# EAGLE schematic Rover V0 (EAGLE 8.3.1)

## Sheet 1 of 4
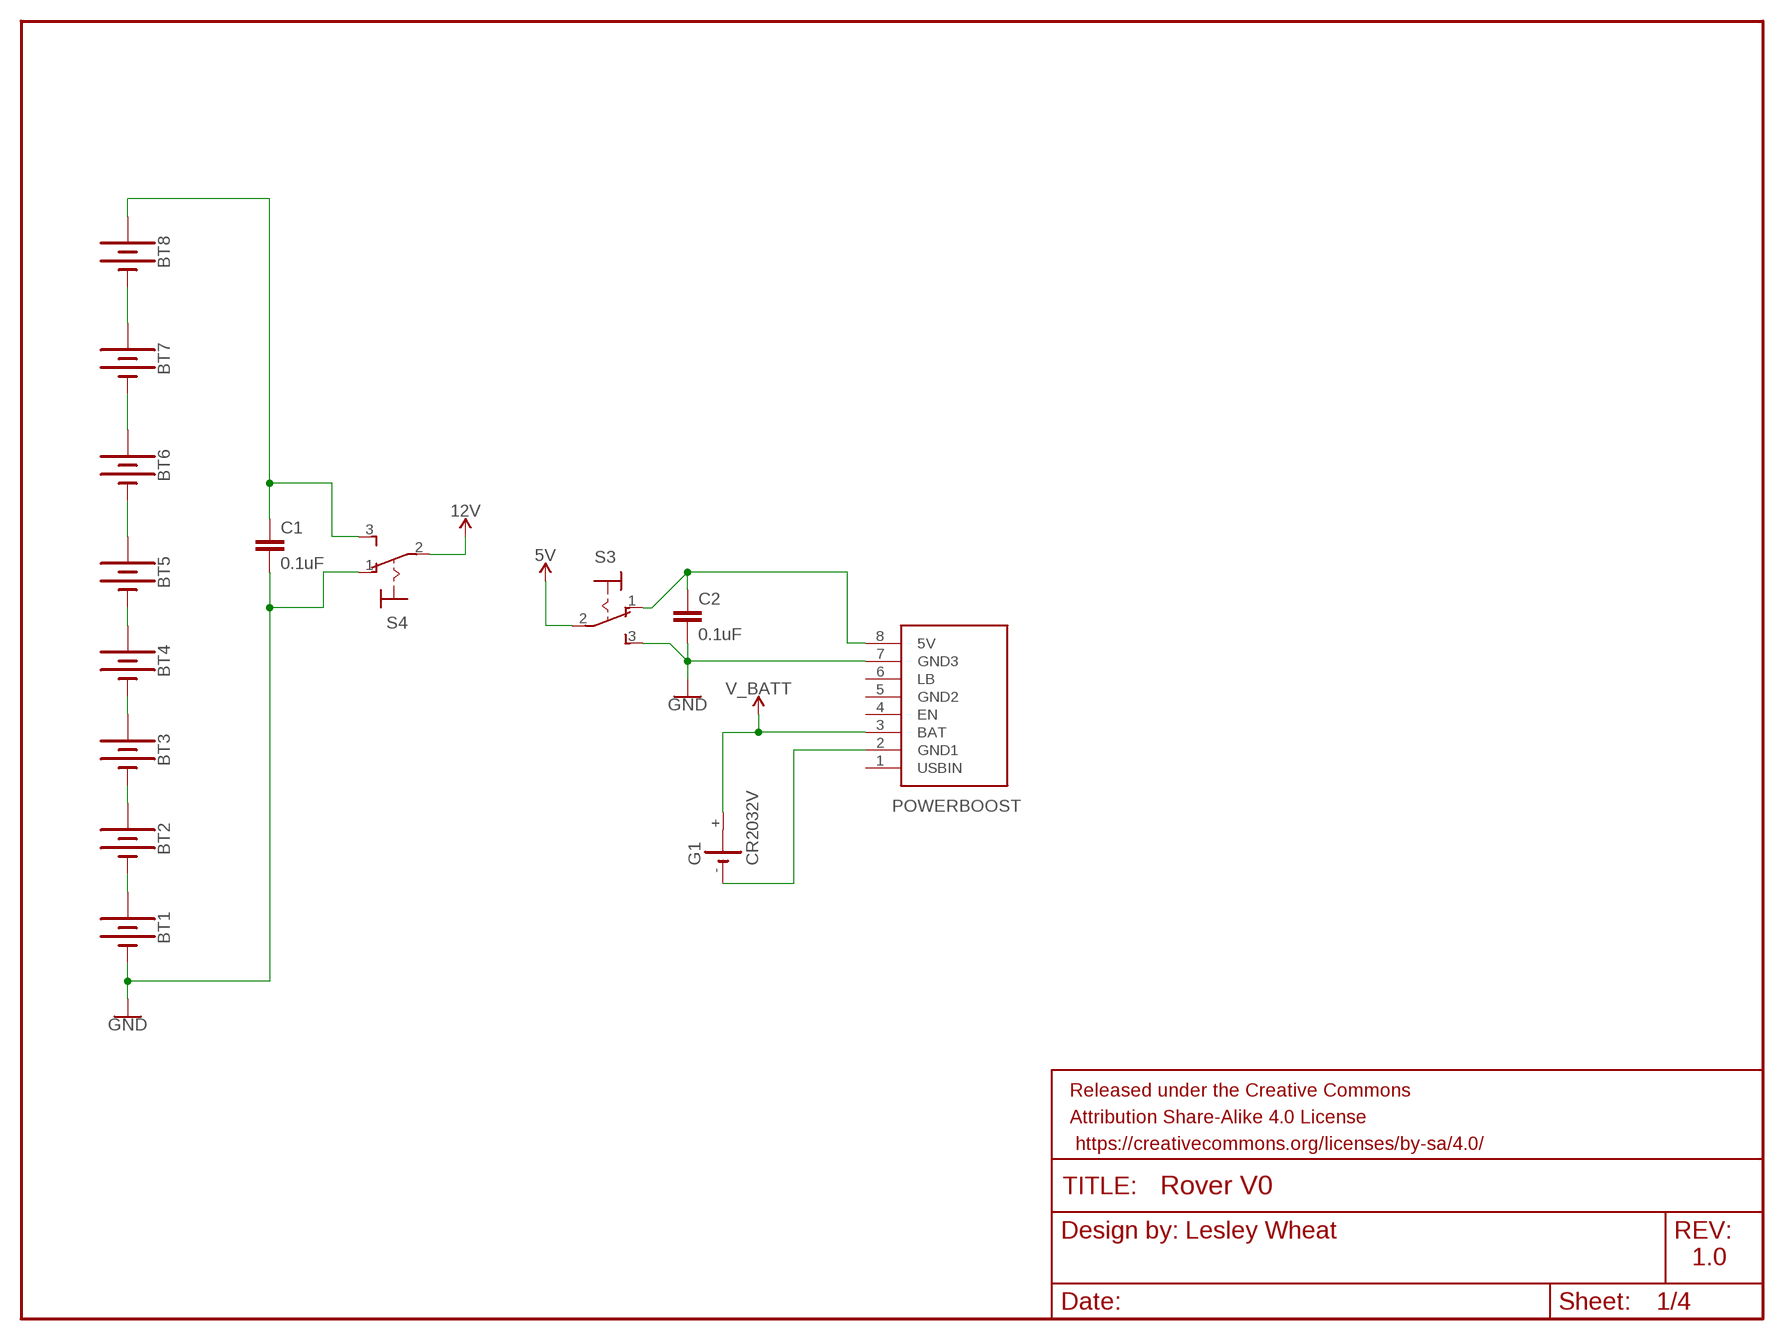
[diagram p0: schematic, sheet 1]

### Parts
BT1  BATTERY-AA  [BATTERY-AA]
BT2  BATTERY-AA  [BATTERY-AA]
BT3  BATTERY-AA  [BATTERY-AA]
BT4  BATTERY-AA  [BATTERY-AA]
BT5  BATTERY-AA  [BATTERY-AA]
BT6  BATTERY-AA  [BATTERY-AA]
BT7  BATTERY-AA  [BATTERY-AA]
BT8  BATTERY-AA  [BATTERY-AA]
C1  0.1uF  0.1UF-0402-16V-10%  [0402]
C2  0.1uF  0.1UF-0402-16V-10%  [0402]
FRAME1  FRAME-LETTER  [CREATIVE_COMMONS]
G1  CR2032V  [CR2032V]
S3  M9040P  [M9040P]
S4  M9040P  [M9040P]
U$1  POWERBOOST500C  [POWERBOOST500]

### Nets
5V: S3.2(P) ; also sheet 2,3,4
12V: S4.2(P) ; also sheet 2
GND: BT1.GND@1(-) C1.2 C2.2 S3.3(S) S4.1(O) U$1.7(GND3) ; also sheet 2,3,4
N$1: BT1.PWR@1(+) BT2.GND@1(-)
N$2: BT2.PWR@1(+) BT3.GND@1(-)
N$3: BT3.PWR@1(+) BT4.GND@1(-)
N$4: BT4.PWR@1(+) BT5.GND@1(-)
N$5: BT5.PWR@1(+) BT6.GND@1(-)
N$6: BT6.PWR@1(+) BT7.GND@1(-)
N$7: BT7.PWR@1(+) BT8.GND@1(-)
N$8: G1.- U$1.2(GND1)
N$19: BT8.PWR@1(+) C1.1 S4.3(S)
N$21: C2.1 S3.1(O) U$1.8(5V)
V_BATT: G1.+ U$1.3(BAT) ; also sheet 2
Unconnected: G1.+@1(+) U$1.1(USBIN) U$1.4(EN) U$1.5(GND2) U$1.6(LB)

### Notes on the sheet
- Lesley Wheat
- 1.0

## Sheet 2 of 4
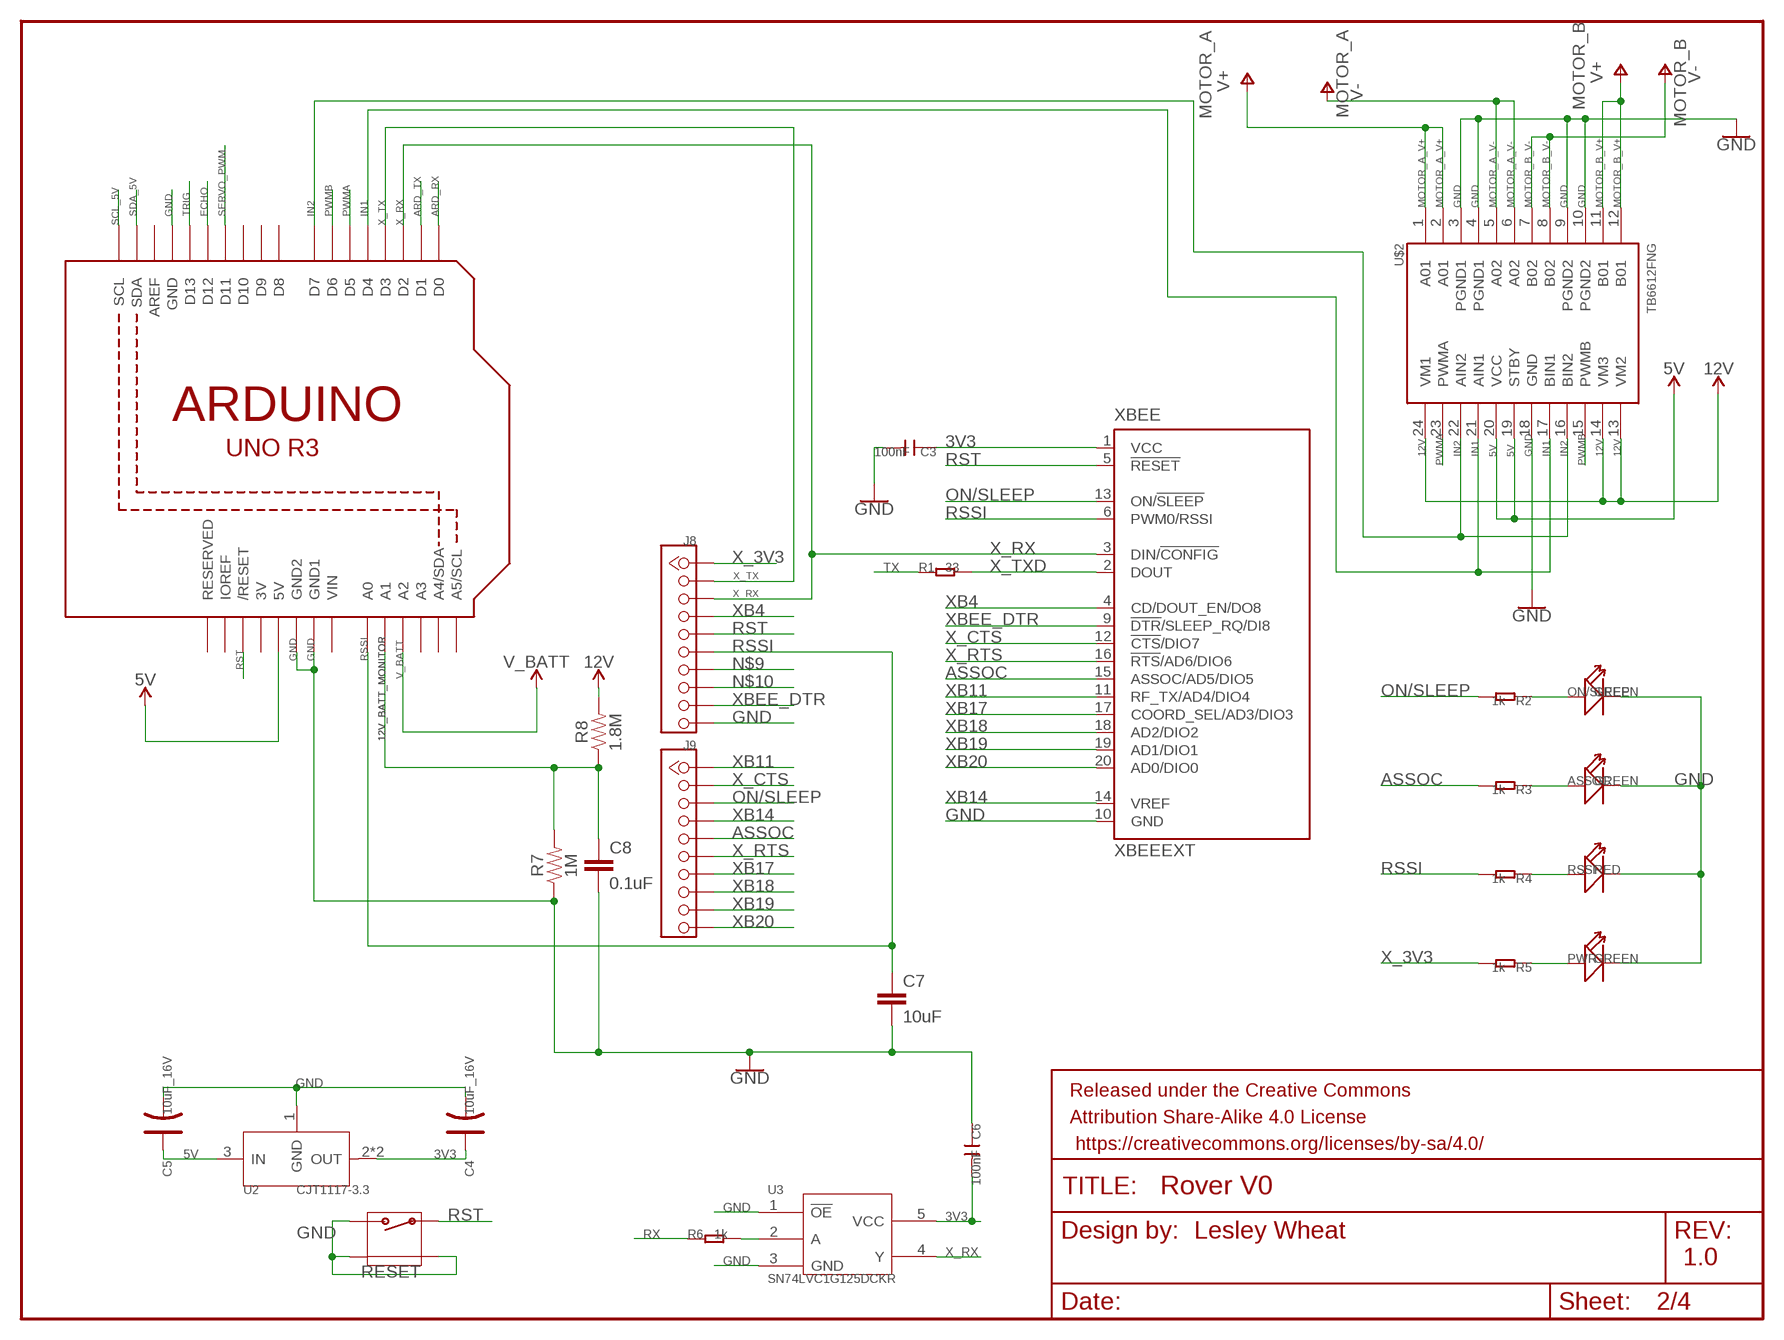
[diagram p1: schematic, sheet 2]

### Parts
ASSOC  GREEN  LED'0603'  [LED-0603]
C3  100nF  C-0603  [C0603]
C4  10uF_16V  CAP-AVX-A  [AVX-A]
C5  10uF_16V  CAP-AVX-A  [AVX-A]
C6  100nF  C-0603  [C0603]
C7  10uF  10UF-0603-6.3V-20%  [0603]
C8  0.1uF  0.1UF-0402-16V-10%  [0402]
FRAME2  FRAME-LETTER  [CREATIVE_COMMONS]
J8  DNP  CK1X10DD  [CK1X10]
J9  DNP  CK1X10DD  [CK1X10]
ON/SLEEP  GREEN  LED'0603'  [LED-0603]
PWR  GREEN  LED'0603'  [LED-0603]
R1  33  R-0603  [R0603]
R2  1k  R-0603  [R0603]
R3  1k  R-0603  [R0603]
R4  1k  R-0603  [R0603]
R5  1k  R-0603  [R0603]
R6  1k  R-0603  [R0603]
R7  1M  1MOHM-0603-1/4W-5%  [0603]
R8  1.8M  1.8MOHM  [0603]
RESET  FOR_TEST_ALBERT_V6_BUTTON_4P_SMD  [FOR_TEST_ALBERT_V6_4P-SMD-7X3.5X3.5]
RSSI  RED  LED'0603'  [LED-0603]
U2  CJT1117-3.3  LD1117S  [SOT-223]
U3  SN74LVC1G125DCKR  [SOT353]
U4  ARDUINOR3-BPLACE  [ARDUINOR3-BPLACE]
U$2  TB6612FNG  [SSOP24]
XBEE  XBEEEXT  [XBEE_PLUG]

### Nets
3V3: C3.1 C4.+ C6.2 U2.2(OUT) U2.TER(OUT) U3.5(VCC) XBEE.1(VCC)
5V: C5.+ U2.3(IN) U4.5V U$2.19(STBY) U$2.20(VCC) ; also sheet 1,3,4
12V: R8.2 U$2.13(VM2) U$2.14(VM3) U$2.24(VM1) ; also sheet 1
12V_BATT_MONITOR: C8.1 R7.2 R8.1 U4.A1
ARD_RX: U4.D0 ; also sheet 4
ARD_TX: U4.D1 ; also sheet 4
ASSOC: J9.5 R3.2 XBEE.15(ASSOC/AD5/DIO5)
ECHO: U4.D12 ; also sheet 3
GND: ASSOC.- C3.2 C4.- C5.- C6.1 C7.2 C8.2 J8.10 ON/SLEEP.- PWR.- R7.1 RESET.2 RESET.S1 RESET.S2 RSSI.- U2.1(GND) U3.1(!OE!) U3.3(GND) U4.GND U4.GND1 U4.GND2 U$2.3(PGND1) U$2.4(PGND1) U$2.9(PGND2) U$2.10(PGND2) U$2.18(GND) XBEE.10(GND) ; also sheet 1,3,4
IN1: U4.D4 U$2.17(BIN1) U$2.21(AIN1)
IN2: U4.D7 U$2.16(BIN2) U$2.22(AIN2)
MOTOR_A_V+: U$2.1(A01) U$2.2(A01) ; supply symbol labelled V+
MOTOR_A_V-: U$2.5(A02) U$2.6(A02) ; supply symbol labelled V-
MOTOR_B_V+: U$2.11(B01) U$2.12(B01) ; supply symbol labelled V+
MOTOR_B_V-: U$2.7(B02) U$2.8(B02) ; supply symbol labelled V-
N$9: J8.7 ON/SLEEP.+ R2.1
N$10: ASSOC.+ J8.8 R3.1
N$11: R4.1 RSSI.+
N$14: PWR.+ R5.1
N$132: R6.2 U3.2(A)
ON/SLEEP: J9.3 R2.2 XBEE.13(ON/!SLEEP)
PWMA: U4.D5 U$2.23(PWMA)
PWMB: U4.D6 U$2.15(PWMB)
RSSI: C7.1 J8.6 R4.2 U4.A0 XBEE.6(PWM0/RSSI)
RST: J8.5 RESET.1 U4.RESET(/RESET) XBEE.5(!RESET) ; also sheet 4
RX: R6.1
SCL_5V: U4.SCL ; also sheet 3
SDA_5V: U4.SDA ; also sheet 3
SERVO_PWM: U4.D11 ; also sheet 3
TRIG: U4.D13 ; also sheet 3
TX: R1.1
V_BATT: U4.A2 ; also sheet 1
X_3V3: J8.1 R5.2
X_CTS: J9.2 XBEE.12(!CTS!/DIO7)
X_RTS: J9.6 XBEE.16(!RTS!/AD6/DIO6)
X_RX: J8.3 U3.4(Y) U4.D2 XBEE.3(DIN/!CONFIG)
X_TX: J8.2 U4.D3
X_TXD: R1.2 XBEE.2(DOUT)
XB4: J8.4 XBEE.4(CD/DOUT_EN/DO8)
XB11: J9.1 XBEE.11(RF_TX/AD4/DIO4)
XB14: J9.4 XBEE.14(VREF)
XB17: J9.7 XBEE.17(COORD_SEL/AD3/DIO3)
XB18: J9.8 XBEE.18(AD2/DIO2)
XB19: J9.9 XBEE.19(AD1/DIO1)
XB20: J9.10 XBEE.20(AD0/DIO0)
XBEE_DTR: J8.9 XBEE.9(!DTR!/SLEEP_RQ/DI8)
Unconnected: U4.A3 U4.A4(A4/SDA) U4.A5(A5/SCL) U4.AREF U4.D8 U4.D9 U4.D10 U4.IOREF U4.RESERVED

### Notes on the sheet
- Lesley Wheat
- 1.0

## Sheet 3 of 4
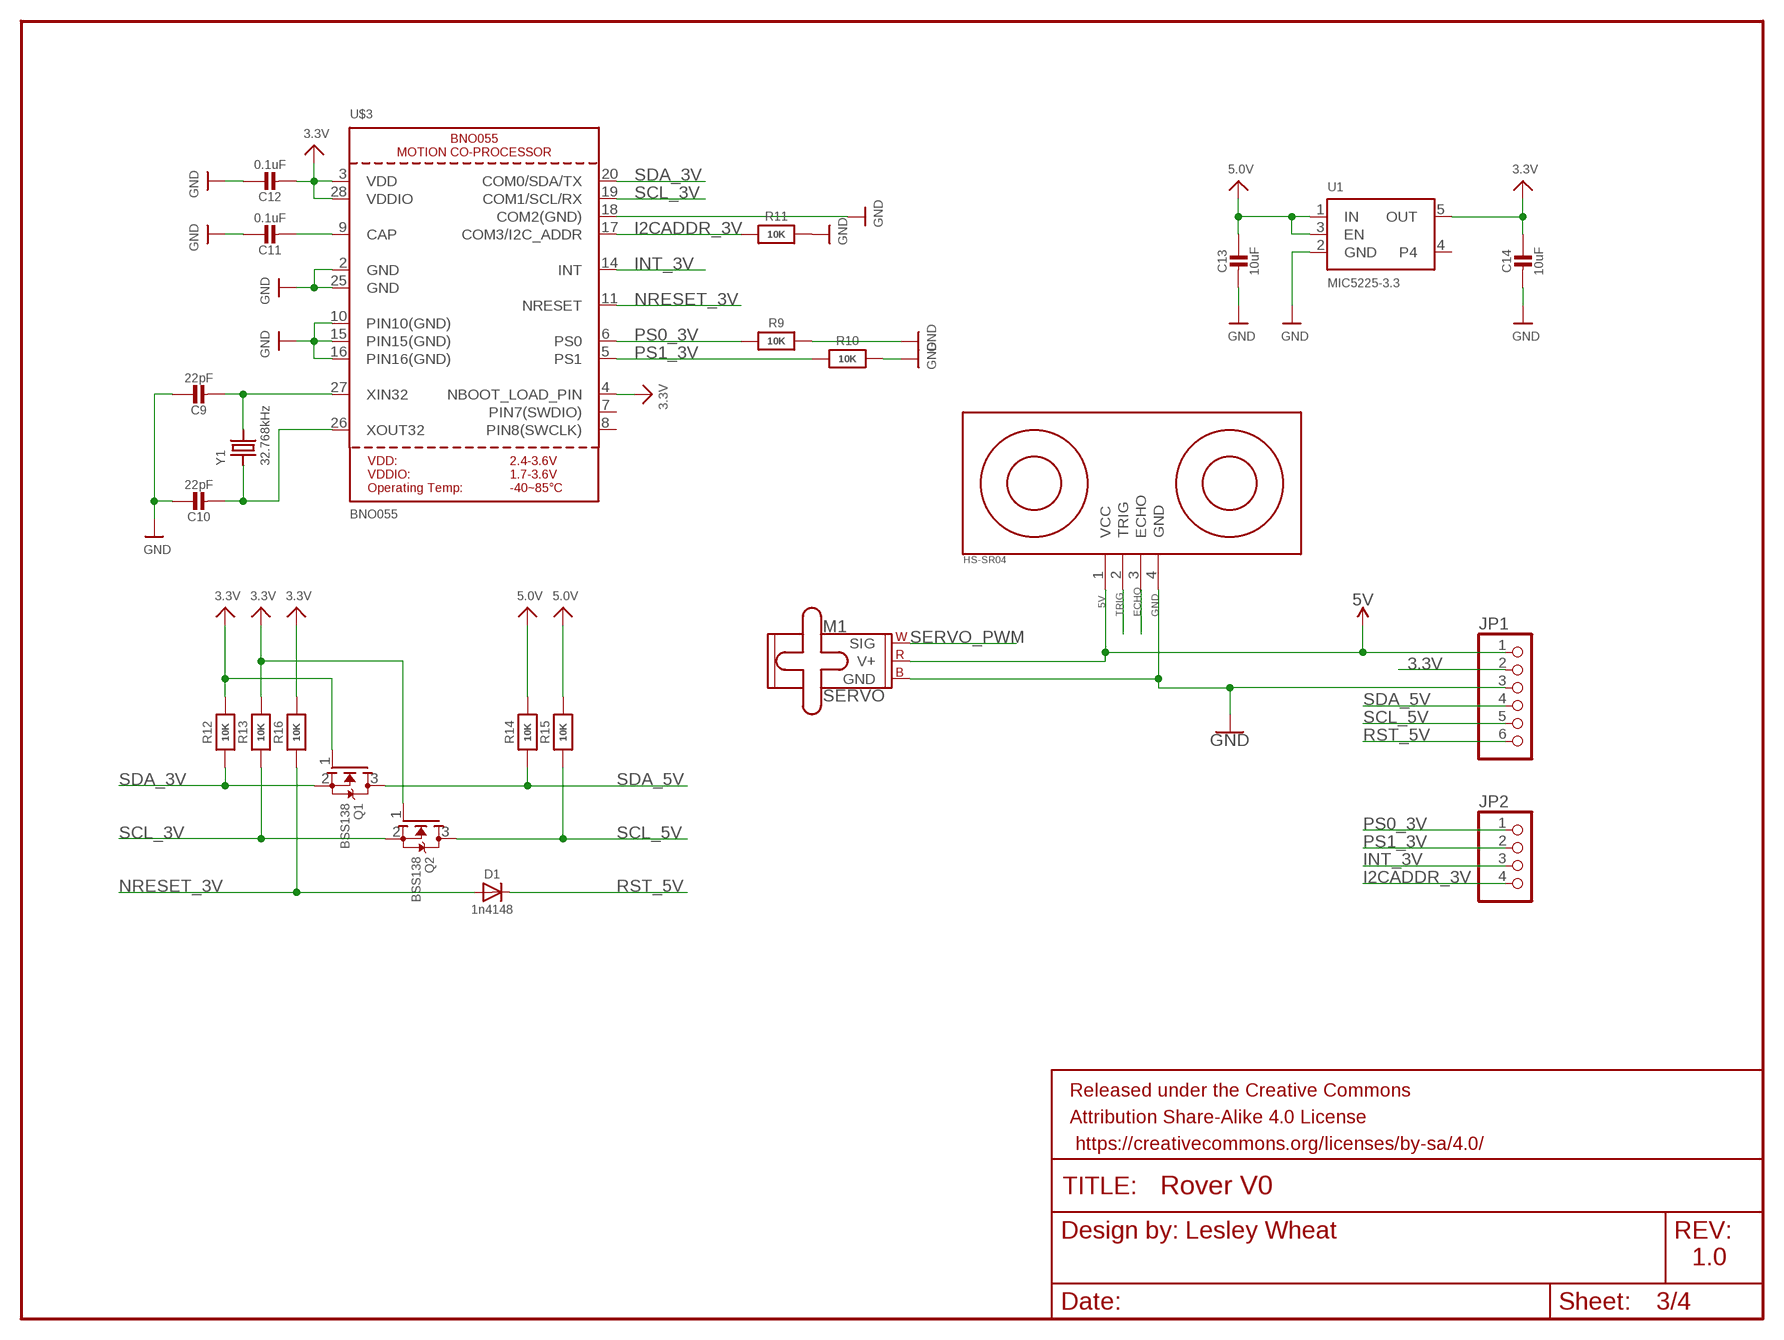
[diagram p2: schematic, sheet 3]

### Parts
C9  22pF  CAP_CERAMIC0805-NOOUTLINE  [0805-NO]
C10  22pF  CAP_CERAMIC0805-NOOUTLINE  [0805-NO]
C11  0.1uF  CAP_CERAMIC0805-NOOUTLINE  [0805-NO]
C12  0.1uF  CAP_CERAMIC0805_10MGAP  [0805_10MGAP]
C13  10uF  CAP_CERAMIC0805-NOOUTLINE  [0805-NO]
C14  10uF  CAP_CERAMIC0805_10MGAP  [0805_10MGAP]
D1  1n4148  DIODESOD-323  [SOD-323]
FRAME3  FRAME-LETTER  [CREATIVE_COMMONS]
JP1  HEADER-1X676MIL  [1X06_ROUND_76]
JP2  HEADER-1X476MIL  [1X04_ROUND_76]
M1  SERVO  [1X03]
Q1  BSS138  MOSFET-NWIDE  [SOT23-WIDE]
Q2  BSS138  MOSFET-NWIDE  [SOT23-WIDE]
R9  10K  RESISTOR0805_NOOUTLINE  [0805-NO]
R10  10K  RESISTOR0805_NOOUTLINE  [0805-NO]
R11  10K  RESISTOR0805_NOOUTLINE  [0805-NO]
R12  10K  RESISTOR0805_NOOUTLINE  [0805-NO]
R13  10K  RESISTOR0805_NOOUTLINE  [0805-NO]
R14  10K  RESISTOR_0805MP  [_0805MP]
R15  10K  RESISTOR_0805MP  [_0805MP]
R16  10K  RESISTOR0805_NOOUTLINE  [0805-NO]
U1  MIC5225-3.3  VREG_SOT23-5  [SOT23-5]
U$3  BNO055  [BNO055]
U$10  ULTRASONIC-HC-SR04  [ULTRASONIC-HC-SR04]
Y1  32.768kHz  CRYSTAL8.0X3.8  [CRYSTAL_8X3.8]

### Nets
3.3V: C12.2 C14.1 JP1.2 Q1.1(G) Q2.1(G) R12.2 R13.2 R16.2 U1.5(OUT) U$3.3(VDD) U$3.4(NBOOT_LOAD_PIN) U$3.28(VDDIO)
5.0V: C13.1 R14.2 R15.2 U1.1(IN) U1.3(EN)
5V: JP1.1 M1.2(V+) U$10.1(VCC) ; also sheet 1,2,4
ECHO: U$10.3(ECHO) ; also sheet 2
GND: C9.1 C10.1 C11.1 C12.1 C13.2 C14.2 JP1.3 M1.3(GND) R9.2 R10.2 R11.2 U1.2(GND) U$3.2(GND) U$3.10(PIN10(GND)) U$3.15(PIN15(GND)) U$3.16(PIN16(GND)) U$3.18(COM2(GND)) U$3.25(GND) U$10.4(GND) ; also sheet 1,2,4
I2CADDR_3V: JP2.4 R11.1 U$3.17(COM3/I2C_ADDR)
INT_3V: JP2.3 U$3.14(INT)
N$12: C9.2 U$3.27(XIN32) Y1.P$4
N$13: C10.2 U$3.26(XOUT32) Y1.P$1
N$15: C11.2 U$3.9(CAP)
NRESET_3V: D1.A R16.1 U$3.11(NRESET)
PS0_3V: JP2.1 R9.1 U$3.6(PS0)
PS1_3V: JP2.2 R10.1 U$3.5(PS1)
RST_5V: D1.C JP1.6
SCL_3V: Q2.2(S) R13.1 U$3.19(COM1/SCL/RX)
SCL_5V: JP1.5 Q2.3(D) R15.1 ; also sheet 2
SDA_3V: Q1.2(S) R12.1 U$3.20(COM0/SDA/TX)
SDA_5V: JP1.4 Q1.3(D) R14.1 ; also sheet 2
SERVO_PWM: M1.1(SIG) ; also sheet 2
TRIG: U$10.2(TRIG) ; also sheet 2
Unconnected: U1.4 U$3.7(PIN7(SWDIO)) U$3.8(PIN8(SWCLK))

### Notes on the sheet
- Lesley Wheat
- 1.0

## Sheet 4 of 4
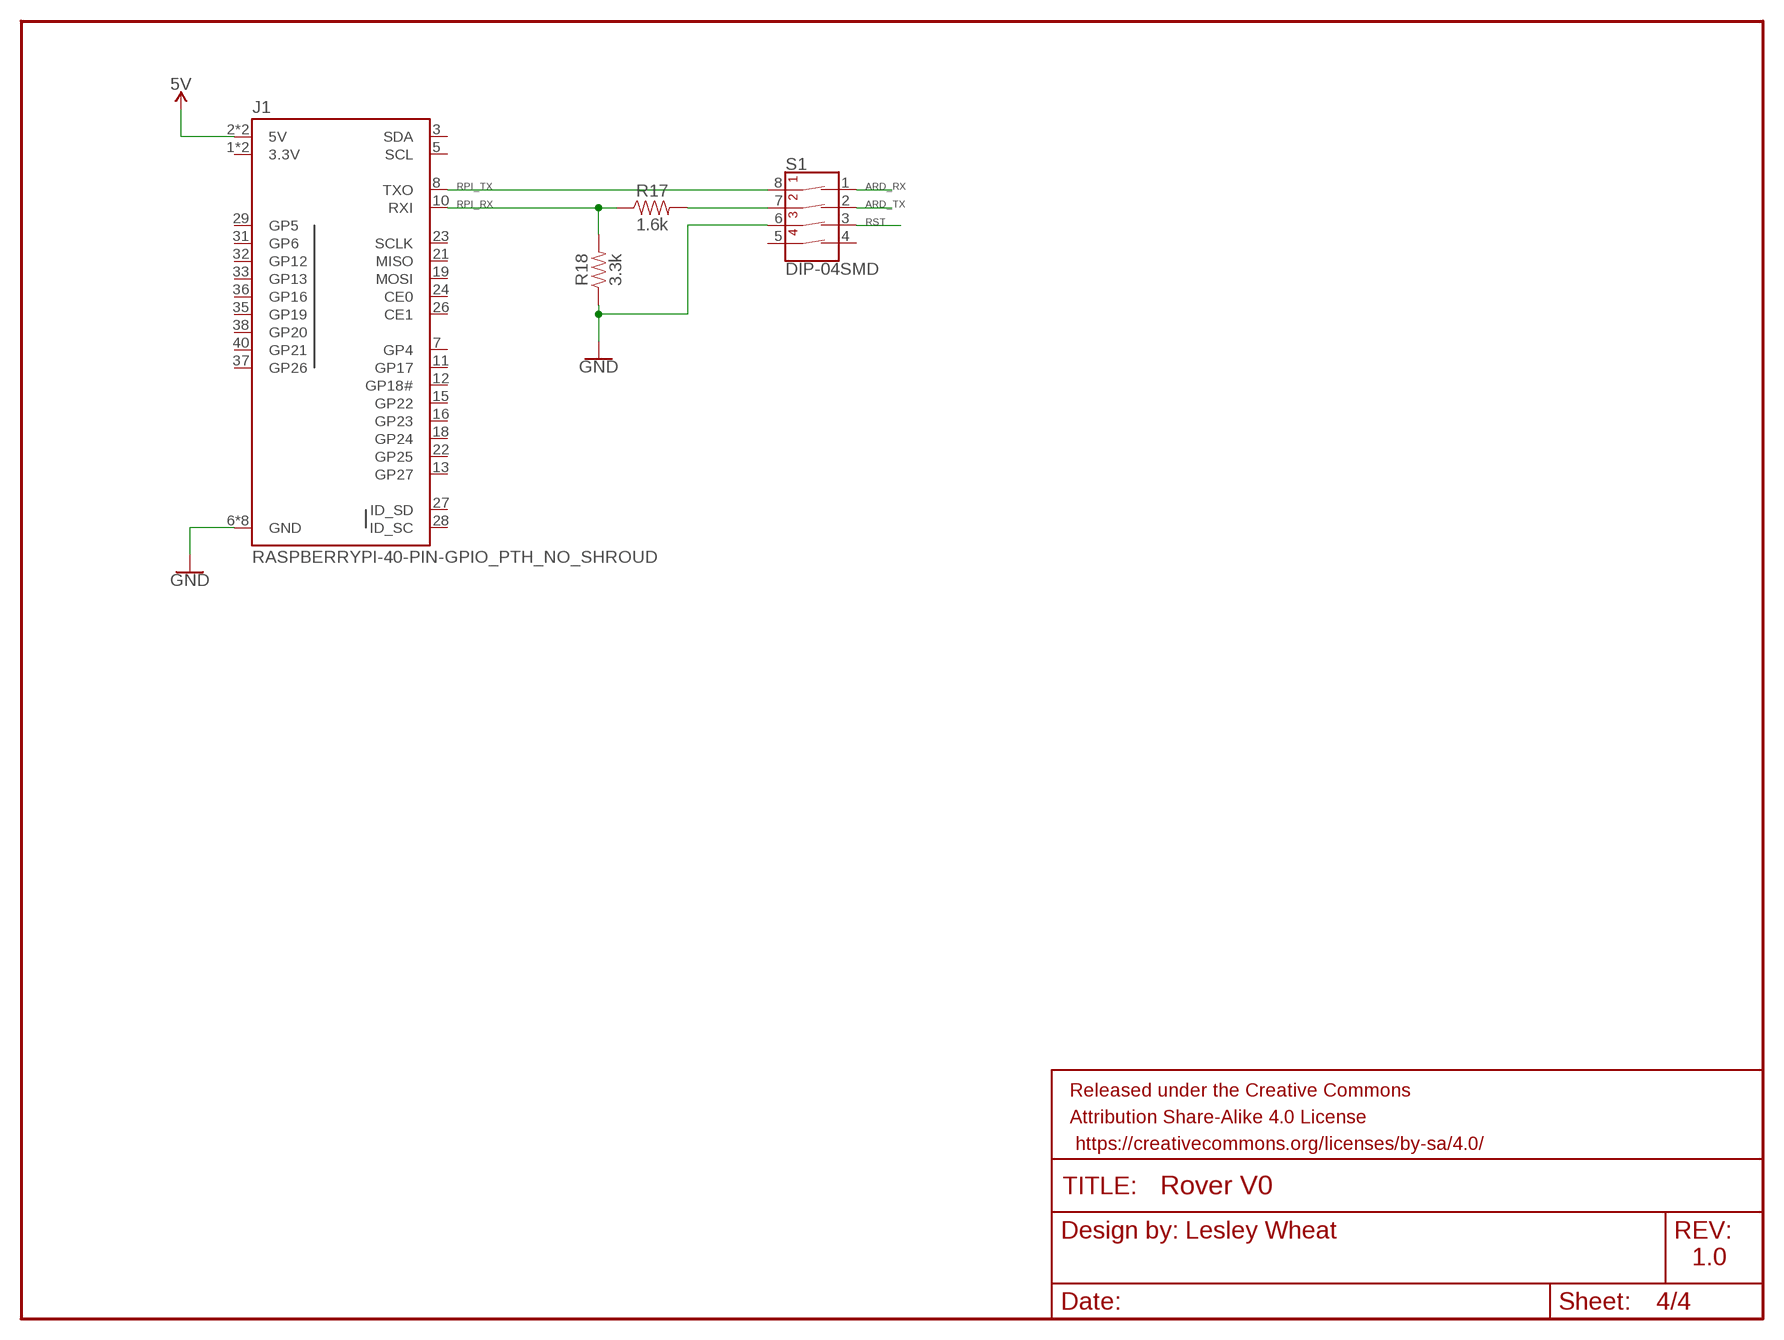
[diagram p3: schematic, sheet 4]

### Parts
FRAME4  FRAME-LETTER  [CREATIVE_COMMONS]
J1  RASPBERRYPI-40-PIN-GPIO_PTH_NO_SHROUD  [2X20]
R17  1.6k  1.6KOHM-0603-1/10W-1%  [0603]
R18  3.3k  3.3KOHM-0603-1/10W-1%  [0603]
S1  DIP-04SMD  [DIPSWITCH-04-SMD]

### Nets
5V: J1.2(5V) J1.4(5V) ; also sheet 1,2,3
ARD_RX: S1.1(1A) ; also sheet 2
ARD_TX: S1.2(2A) ; also sheet 2
GND: J1.6(GND) J1.9(GND) J1.14(GND) J1.20(GND) J1.25(GND) J1.30(GND) J1.34(GND) J1.39(GND) R18.1 S1.6(3B) ; also sheet 1,2,3
N$18: R17.2 S1.7(2B)
RPI_RX: J1.10(RXI) R17.1 R18.2
RPI_TX: J1.8(TXO) S1.8(1B)
RST: S1.3(3A) ; also sheet 2
Unconnected: J1.3(SDA) J1.5(SCL) J1.7(GP4) J1.11(GP17) J1.12(GP18#) J1.13(GP27) J1.15(GP22) J1.16(GP23) J1.18(GP24) J1.19(MOSI) J1.21(MISO) J1.22(GP25) J1.23(SCLK) J1.24(CE0) J1.26(CE1) J1.27(ID_SD) J1.28(ID_SC) J1.29(GP5) J1.31(GP6) J1.32(GP12) J1.33(GP13) J1.35(GP19) J1.36(GP16) J1.37(GP26) J1.38(GP20) J1.40(GP21) S1.4(4A) S1.5(4B)

### Notes on the sheet
- Lesley Wheat
- 1.0

## Power pins joined to a net without a drawn wire
3.3V: J1.1(3.3V) J1.17(3.3V)
3V: U4.3V
VIN: U4.VIN

## Library data of the parts
ASSOC ON/SLEEP PWR RSSI = Discrete:LED*
BT1-BT8 = SparkFun-Batteries:BATTERY: Battery - Single Cell A variety of battery chemistries, sizes, and footprints. Device List: 20MM_PTH - Coin Cell Battery Holder - 20mm (PTH) <https://www.sparkfun.com/products/783> 20MM_PTH_KIT- Coin Cell battery Holder - 20 mm (PTH) <http://www.sparkfun.com/products/783>kit version with special mask 6.8MM_PTH - Coin Cell Battery Holder - 6.8MM(SMD) <https://www.digikey.com/product-detail/en/seiko-instruments/MS621FE-FL11E/728-1057-ND/1889208?WT.srch=1&gclid=CNOQ5a6LzdQCFZS2wAodXCkE0g> 12MM_SMD - Coin Cell Battery Holder - 12mm (SMD) <https://www.sparkfun.com/products/10592> 12MM_PTH - Coin Cell Battery Holder - 12mm (PTH) <https://www.sparkfun.com/products/7948> 20MM_SMD - 20mm Coin Cell Battery Holder (SMD) (2 legs) Used on the Big Time Watch Kit <https://www.sparkfun.com/products/11734> 20MM_SMD_4LEGS - Coin Cell Battery Holder - 20mm (SMD) <https://www.sparkfun.com/products/11892> 20MM_SMD_4LEGS_OVERPASTE - Coin Cell Battery Holder - 20mm (SMD) <https://www.sparkfun.com/products/11892> (Over-paste on the legs) 24.5MM_PTH - Coin Cell Battery Holder - 24.5mm (PTH) <https://www.sparkfun.com/products/8863> 9V - 9V Battery Holder - PC Mount Used on the SparkFun SparkPunk Sound Kit <https://www.sparkfun.com/products/11177> and SparkFun SparkPunk Sequencer Kit <https://www.sparkfun.com/products/12707> 18650 - Battery Holder - 18650 (PTH) <https://www.sparkfun.com/products/13113> AA - Battery Holder - 1xAA (PTH) <https://www.sparkfun.com/products/7949> AAA - Battery Holder - 1xAAA (PTH) <https://www.sparkfun.com/products/12718> AA_KIT - Battery Holder - 1xAA (PTH) <https://www.sparkfun.com/products/7949> Special kit package - pads only have exposed copper on one side of the board. AAA_KIT - Battery Holder - 1xAAA (PTH) <https://www.sparkfun.com/products/12718> Special kit package - pads only have exposed copper on one side of the board.; PROD_ID: BATT-08316; SF_SKU: PRT-07949
C1 C2 C8 = SparkFun-Capacitors:0.1UF: 0.1µF ceramic capacitors A capacitor is a passive two-terminal electrical component used to store electrical energy temporarily in an electric field.; PROD_ID: CAP-12416
C3 C6 = Discrete:C*: Ceramic Capacitors
C4 C5 = Discrete:CAP*: Electrolytic Capacitors,Tantalum Capacitors and Super Capacitors
C7 = SparkFun-Capacitors:10UF: 10.0µF ceramic capacitors A capacitor is a passive two-terminal electrical component used to store electrical energy temporarily in an electric field.; PROD_ID: CAP-11015
C9-C14 = microbuilder:CAP_CERAMIC: Ceramic Capacitors For new designs, use the packages preceded by an '_' character since they are more reliable: The following footprints should be used on most boards: _0402 - Standard footprint for regular board layouts _0603 - Standard footprint for regular board layouts _0805 - Standard footprint for regular board layouts _1206 - Standard footprint for regular board layouts For extremely tight-pitch boards where space is at a premium, the following 'micro-pitch' footprints can be used (smaller pads, no silkscreen outline, etc.): _0402MP - Micro-pitch footprint for very dense/compact boards _0603MP - Micro-pitch footprint for very dense/compact boards _0805MP - Micro-pitch footprint for very dense/compact boards _1206MP - Micro-pitch footprint for very dense/compact boards
D1 = microbuilder:DIODE: Diode SMA Model Volts Amps Type Vf Ir Digikey # Notes SSA34-E3 40V 3A Schottky 480mV @ 3A 200uA @ 40V SSA34-E3/61TGITR-ND CDBA120-G 20V 1A Schottky 500mV @ 1A 500uA @ 20V 641-1014-6-ND REEL MBRA210 10V 2A Schottky 350mV @ 2A 700uA @ 10V MBRA210LT3 SOD-123 Model Volts Amps Type Vf Ir Order # Notes BAT54T1G 30V 200mA Schottky 800mV @ 200mA 2uA @ 25V BAT54T1GOSTR-ND B0530W 30V 500mA Schottky 430mV @ 500mA 130uA @ 30V B0530W-FDICT-ND REEL MBR120 20V 1A Schottky 340mV @ 1A MBR120VLSFT1GOSCT-ND SOD-323 Model Volts Amps Type Vf Ir Order # Notes PMEG2005EJ 20V 500mA Schottky 355mV @ 500mA 568-4110-1-ND ZLLS410 10V 570mA Schottky 380mV @ 570mA ZLLS410CT-ND 1N4148WS 75V 150mA Silicon/Simple 1V 1N4148WSFSCT-ND REEL SOD-523 Model Volts Amps Type Vf Ir Order # Notes BAT54XV2 30V 200mA Schottky 0.8V @ 100mA BAT54XV2CT-ND TB751S 30V 30mA Schottky RB751S-40TE61CT-ND SOT23-R/W (R = Solder Paste/Reflow Ovens, W = Hand-Soldering) Model Volts Amps Type Vf Ir Order # Notes BAT54FILM 40V 300mA Schottky 497-7162-1-ND POWERDI-5 Model Volts Amps Type Vf Ir Order # Notes PDS560 60V 5A Schottky 670mV @ 5A 150uA @ 60V PDS560DICT-ND
FRAME1-FRAME4 = SparkFun-Aesthetics:FRAME-LETTER: Schematic Frame - Letter Standard 8.5x11 US Letter frame
G1 = battery:CR2032V: LI BATTERY Varta
J1 = SparkFun-Connectors:RASPBERRYPI-40-PIN-GPIO: Raspberry Pi GPIO Header 2x20 pin connector, as found on B, B+, A+ models. Both shrouded PTH and SMT versions available. SparkFun Products: GPIO Shrouded Header <https://www.sparkfun.com/products/13054>- PTH SparkFun Pi Wedge (Preassembled) <https://www.sparkfun.com/products/13717>
J8 J9 = CONNECTER:CK1X10
JP1 = microbuilder:HEADER-1X6: PIN HEADER
JP2 = microbuilder:HEADER-1X4: PIN HEADER
M1 = SparkFun-Electromechanical:SERVO: Servo Motor 3-pin connector for a standard servo motor (voltage supply, ground, and control signal.) SparkFun Products Servo - Generic (Sub-Micro Size) <https://www.sparkfun.com/products/9065> (ROB-09065) Servo - Generic High Torque Continuous Rotation (Standard Size) <https://www.sparkfun.com/products/9347> (ROB-09347) Servo - Generic High Torque (Standard Size) <https://www.sparkfun.com/products/11965> (ROB-11965)
Q1 Q2 = microbuilder:MOSFET-N: N-Channel Mosfet LEGEND VDS: Voltage Drain-Source ID: Drain Current RDS(ON): Drain-Source On-State Resistance VGS(TH): Gate-Source Threshold Voltage CISS: Drain-Source Input Capacitance SOT-23 Name VDS ID RDS(ON) VGS(TH) CISS Order Number 2N7002E 60V 260mA 2.5 Ohm 2.5V @ 250uA 26.7pF @ 25V 2N7002ET1GOSTR-ND BSH103 30V 850mA 400 mOhm 400mV @ 1mA 83pF @ 24V BSH103,235-ND BSS138 60V 320mA 1.6 Ohm 1.5V @ 250uA 50pF @ 10V Mouser: 771-BSS138PW115 DMN2075U-7 20V 4.2A 38 mOhm 1V @ 250 uA 594.3pF @ 10V DMN2075U-7DICT-ND * BSS138 good choice for I2C level-shifting POWERPAK 1212-8 Name VDS ID RDS(ON) VGS(TH) CISS Order Number Si7308DN 60V 6A 58 mOhm 3V @ 250uA 665pF @ 15V SI7308DN-T1-E3CT-ND
R1-R6 = Discrete:R*
R7 = SparkFun-Resistors:1MOHM: 1MΩ resistor A resistor is a passive two-terminal electrical component that implements electrical resistance as a circuit element. Resistors act to reduce current flow, and, at the same time, act to lower voltage levels within circuits. - Wikipedia; PROD_ID: RES-07868
R8 = SparkFun-Resistors:1.8MOHM: 1.8 MOhms ±5% 0.1W, 1/10W Chip Resistor 0603; PROD_ID: RES-13994
R9-R16 = microbuilder:RESISTOR: Resistors For new designs, use the packages preceded by an '_' character since they are more reliable: The following footprints should be used on most boards: _0402 - Standard footprint for regular board layouts _0603 - Standard footprint for regular board layouts _0805 - Standard footprint for regular board layouts _1206 - Standard footprint for regular board layouts For extremely tight-pitch boards where space is at a premium, the following 'micro-pitch' footprints can be used (smaller pads, no silkscreen outline, etc.): _0402MP - Micro-pitch footprint for very dense/compact boards _0603MP - Micro-pitch footprint for very dense/compact boards _0805MP - Micro-pitch footprint for very dense/compact boards _1206MP - Micro-pitch footprint for very dense/compact boards
R17 = SparkFun-Resistors:1.6KOHM: 1.6kΩ resistor A resistor is a passive two-terminal electrical component that implements electrical resistance as a circuit element. Resistors act to reduce current flow, and, at the same time, act to lower voltage levels within circuits. - Wikipedia; PROD_ID: RES-08361
R18 = SparkFun-Resistors:3.3KOHM: 3.3kΩ resistor A resistor is a passive two-terminal electrical component that implements electrical resistance as a circuit element. Resistors act to reduce current flow, and, at the same time, act to lower voltage levels within circuits. - Wikipedia; PROD_ID: RES-07851
RESET = TFT_Touch:FOR_TEST_ALBERT_V6_BUTTON_4P_SMD: TS-1188E http://www.best-dz.com/?thread-374-2.html
S1 = SparkFun-Switches:DIP-04: 4-Position DIP Switch 4-circuit DIP (dual inline package) switch. Commonly used to physcially set a circuit's behavior. SparkFun Products Prototype Part; PROD_ID: SWCH-12418
S3 S4 = switch:M9040P: TOGGLE SWITCH Marquardt
U1 = microbuilder:VREG_SOT23-5: SOT23-5 Fixed Voltage Regulators Part Current Out V Out V In V Dropout θJA (°C/W) TJ (°C) Digikey Part No. ADP121 150mA 3.3V 3.4-5.5V 0.09V @ 150mA -- -- ADP121-AUJZ33R7CT-ND ADP121 150mA 3.0V 3.1-5.5V 0.09V @ 150mA -- -- ADP121-AUJZ30R7CT-ND ADP122 300mA 3.3V 3.4-5.5V 0.085V @ 300mA -- -- ADP122AUJZ-3.3-R7CT-ND ADP1712 300mA 3.3V 3.5-5.5V 0.17V @ 300mA -- -- ADP1712AUJZ-3.3-R7TR-ND AP7311 (Low Cost) 150mA 3.3V 3.5-6V 0.15V @ 150mA -- -- AP7311-33WG-7DICT-ND LD39015M18R 150mA 1.8V 1.9V-5.5V 0.08V @ 100mA -- -- 497-6977-1-ND LP2985A-33DBVR 150mA 3.3V 3.3-16V 0.28V @ 150mA 206 150 296-18479-1-ND MCP1824T-3302E/OT 300mA 3.3V 3.5V-6V 0.2V @ 300mA -- -- MCP1824T-3302E/OTCT-ND MIC5205-2.5YM5 TR 150mA 2.5V 2.7-16V 0.165V @ 150mA -- -- 576-1257-2-ND MIC5205-3.0YM5 TR 150mA 3.0V 3.2V-16V 0.165V @ 150mA -- -- 576-1258-2-ND MIC5205-3.3YM5 TR 150mA 3.3V 3.5V-16V 0.165V @ 150mA -- -- 576-1259-2-ND TPS780330220 150mA 3.3V+2.2V 3.6-5.5V 250mV Max -- -- 296-23332-1-ND TDA3663/N1,135 100mA 3.3V 3.5-45V 0.18V @ 50mA -- -- 568-5343-1-ND Max operating temp can be calculated using θJA, TJ (max junction temperature), and power in watts. Set the "Maximum Ambient Temperature" until it reaches TJ ("Max Junction Temperature"), which is the absolute limit for safe use of the regulator: Heat Sink Temperature Calculator <http://www.daycounter.com/Calculators/Heat-Sink-Temperature-Calculator.phtml> For example, With 12V source into a 3.3V LP2985 and a 30mA load, we are dissipating (12V-3.3V) * 0.03A = 0.261W. With a θJA of 206 °C/W, a TJ of 150°C, and 261mW we can safely use the chip without a heat sink up to 75°C (=147.1°C Junction Temperature).
U2 = IC:LD1117: Low Drop Fixed And Adjustable Positive Voltage Regulators http://www.datasheetcatalog.org/datasheet/SGSThomsonMicroelectronics/mXuqtqv.pdf
U3 = Test:SN74LVC1G125DCKR: Signal bus buffer gate
U4 = adafruit:ARDUINOR3: This is a new object for the new Arduino R3 - with extra pins that you may want to use (such as IOref, and duplicated A4/A5
U$1 = jos-ph:POWERBOOST500C: Adafruit PowerBoost 500c https://www.adafruit.com/products/1944 *UNPROVEN*
U$2 = SparkFun-IC-Special-Function:TB6612FNG: Toshiba 1A dual motor driver IC-09363; PROD_ID: IC-09363
U$3 = microbuilder:BNO055: BNO055 - Motion Co-Processor
U$10 = diy-modules:ULTRASONIC-HC-SR04: Ultrasonic Ranging Module HC-SR04
XBEE = EXT_moudle:XBEE: XBee (TM) /XBee-PRO(TM) OEM RF Modules Source: MaxStream, Inc. xbee_productmanual.pdf
Y1 = microbuilder:CRYSTAL: Crystals HC49UP - Surface Mount Crystal 4.0MHz 18pF +/-30ppm Surface Mount Crystal [Digikey: 535-9857-1-ND] 12.0 MHz Surface Mount Crystal [Digikey: 535-9869-6-ND] 25.0 MHz Surface Mount Crystal [Digikey: 535-9078-1-ND] 2.5 x 2.0mm - MEMs SMT Crystal 16.0 MHz 10pF 20ppm 2.5 x 2.0mm Crystal [Digikey -40-85°C: 535-10923-1-ND] 3.2 x 2.5mm - MEMs SMT Crystal 12.0 MHz 8pF 15ppm 3.2 x 2.5mm Crystal [Digikey: -10-70°C: 644-1047-1-ND -40-125°C: 644-1128-1-ND] 40~85°C cheaper: 644-1173-6-ND 16.0 MHz 8pF 15ppm 3.2 x 2.5mm Crystal [Digikey: -10-70°C: 644-1049-1-ND -40-125°C: 644-1129-2-ND]-40~85°C cheaper: 644-1175-6-ND 16.0 MHz 10pF 10ppm 3.2 x 2.5mm Crystal [Digikey: 644-1100-1-ND] 27.12 MHz 18pF 30ppm 3.2 x 2.5mm Crystal [Digikey: 887-1424-1-ND] 27.12MHz 10pF 10ppm 3.2 x 2.5mm Crystal [Digikey: 887-1329-1-ND] 4.9 x 1.8mm - MEMs SMT Crystal 32.768 KHz 12.5pF 20ppm 4.9 x 1.8mm Crystal [Digikey: SE2415CT-ND] 8.0 x 3.8mm - Surface Mount Crystal 32.768kHz 12.5pF 20ppm -40°C-85°C [Digikey: 535-9166-2-ND] Cylinder 32.768KHz Cylinder Crystal (2x6mm body) [Ex. Digikey: 300-8341-2-ND]